# EAGLE design AQ-sensors-Hardware-design (EAGLE 9.3.1)
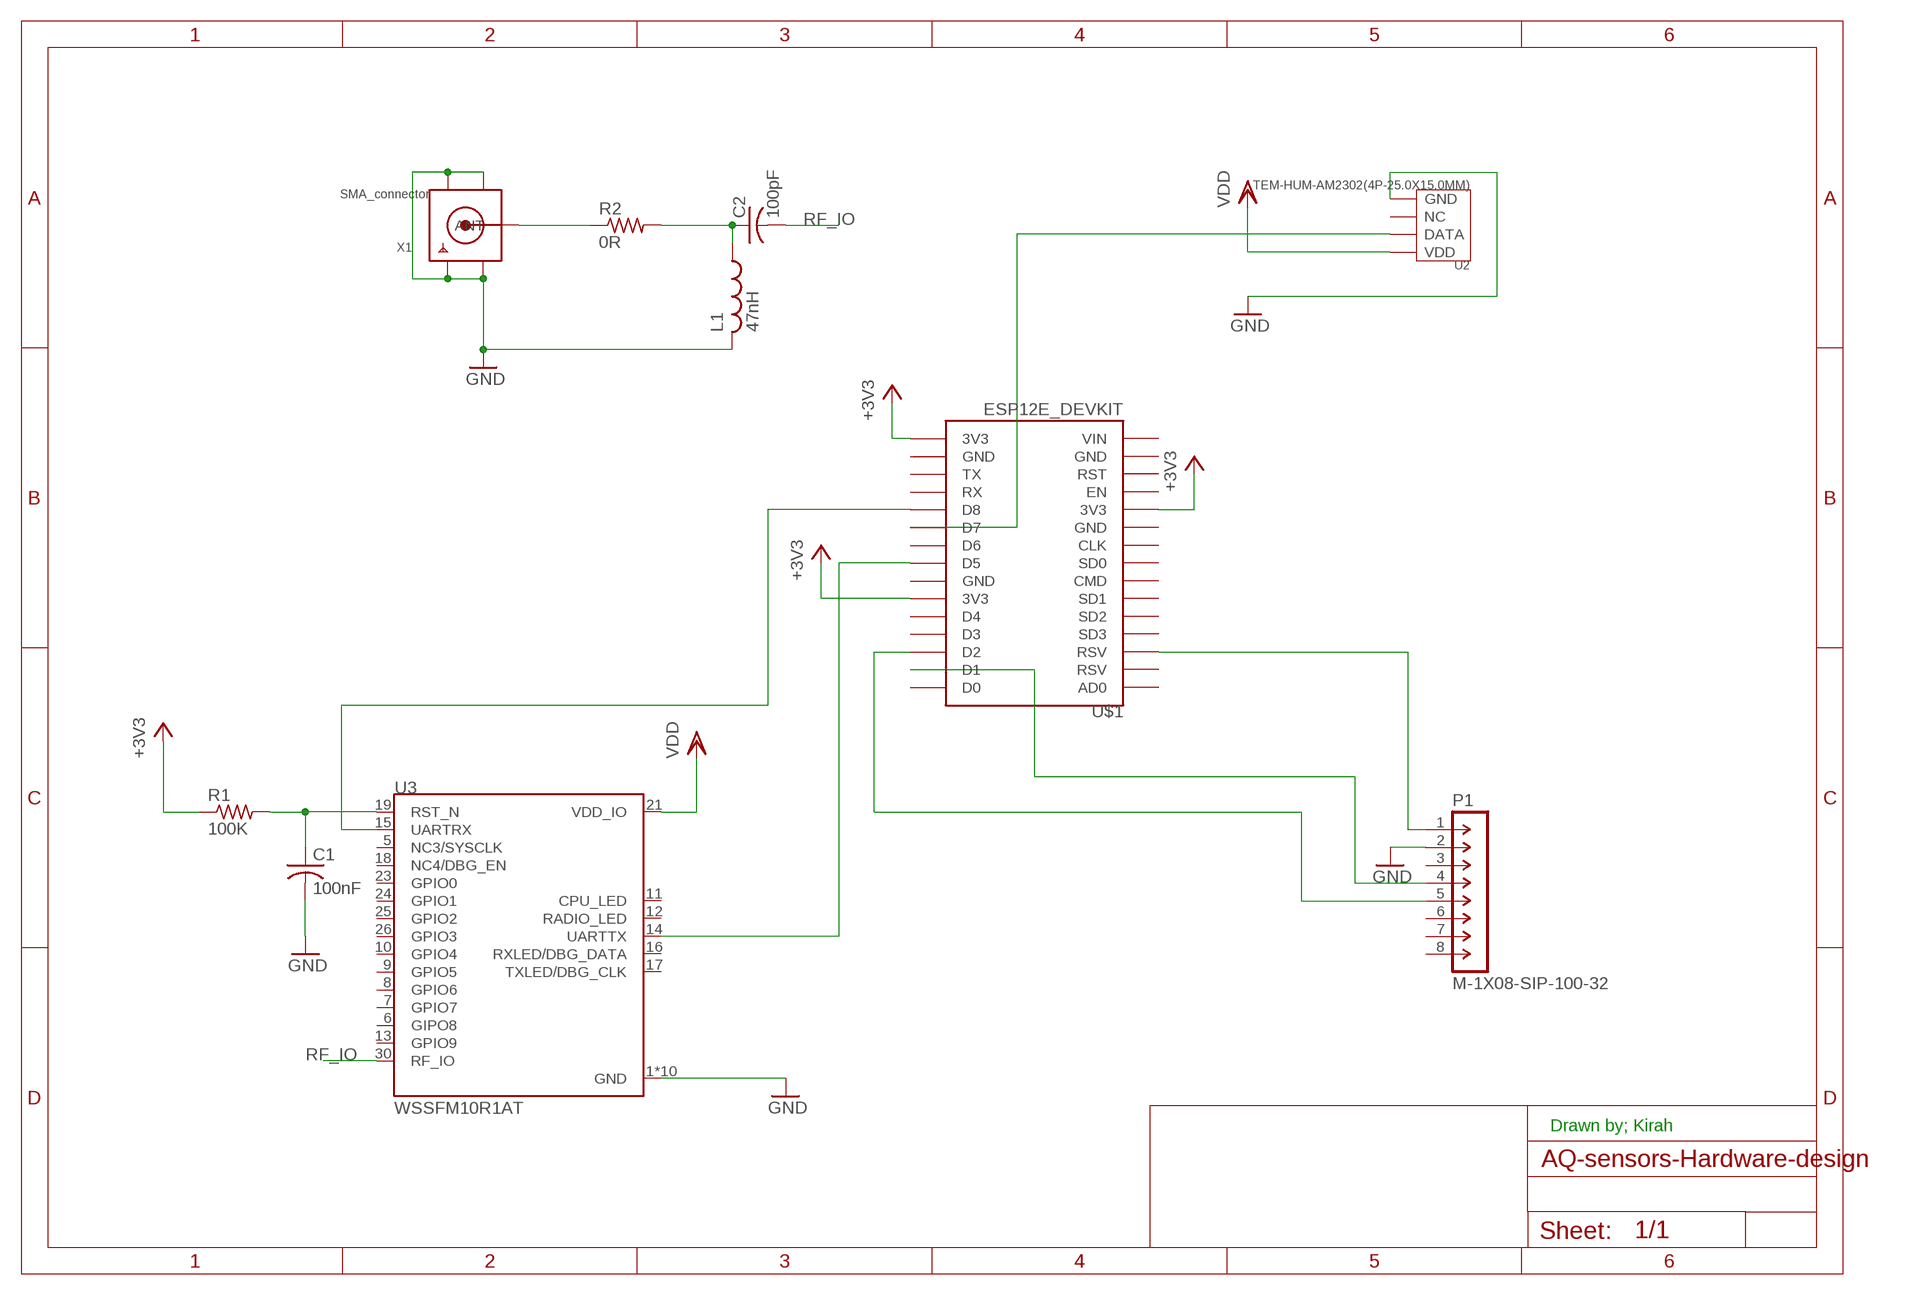
[diagram p0: schematic, sheet 1]

## Parts
C1  100nF  C-US025-025X050  [C025-025X050]
C2  100pF  C-US025-025X050  [C025-025X050]
L1  47nH  L-US0204/7  [0204/7]
P1  M-1X08-SIP-100-32  [SIP-100-08-32]
R1  100K  R-US_0204/7  [0204/7]
R2  0R  R-US_0204/7  [0204/7]
U2  TEM-HUM-AM2302(4P-25.0X15.0MM)  [SNR4-2.54-25.0X15.0X7.0MM]
U3  WSSFM10R1AT  [XCVR_WSSFM10R1AT]
U$1  ESP12E_DEVKIT  [ESP12E_DEVKIT]
X1  SMA_connector  SMACONNECTOR_EDGE_UFL  [SMA_EDGELAUNCH_UFL]

## Nets
+3V3: R1.1 U$1.3V3@0(3V3) U$1.3V3@1(3V3) U$1.3V3@2(3V3)
GND [Gnd]: C1.2 L1.2 P1.2 U2.P$4(GND) U3.1(GND) U3.2(GND) U3.3(GND) U3.4(GND) U3.20(GND) U3.22(GND) U3.27(GND) U3.28(GND) U3.29(GND) U3.31(GND) X1.GND@1(GND1) X1.GND@2(GND2) X1.GND@3(GND3) X1.GND@4(GND4)
N$1: U2.P$2(DATA) U$1.D7
N$2: C1.1 R1.2 U3.19(RST_N)
N$3: C2.1 L1.1 R2.2
N$4: P1.1 U$1.RSV@1(RSV)
N$5: R2.1 X1.P(ANT)
N$9: U3.15(UARTRX) U$1.D8
N$10: U3.14(UARTTX) U$1.D5
N$13: P1.5 U$1.D2
N$14: P1.4 U$1.D1
RF_IO: C2.2 U3.30(RF_IO)
VDD: U2.P$1(VDD) U3.21(VDD_IO)
Unconnected: P1.3 P1.6 P1.7 P1.8 U2.P$3(NC) U3.5(NC3/SYSCLK) U3.6(GIPO8) U3.7(GPIO7) U3.8(GPIO6) U3.9(GPIO5) U3.10(GPIO4) U3.11(CPU_LED) U3.12(RADIO_LED) U3.13(GPIO9) U3.16(RXLED/DBG_DATA) U3.17(TXLED/DBG_CLK) U3.18(NC4/DBG_EN) U3.23(GPIO0) U3.24(GPIO1) U3.25(GPIO2) U3.26(GPIO3) U$1.AD0 U$1.CLK U$1.CMD U$1.D0 U$1.D3 U$1.D4 U$1.D6 U$1.EN U$1.GND@0(GND) U$1.GND@1(GND) U$1.GND@2(GND) U$1.GND@3(GND) U$1.RST U$1.RSV@0(RSV) U$1.RX U$1.SD0 U$1.SD1 U$1.SD2 U$1.SD3 U$1.TX U$1.VIN

## Notes on the sheet
- Drawn by; Kirah

## Library data of the parts
C1 C2 = rcl:C-US: CAPACITOR, American symbol; SPICEPREFIX: C
L1 = rcl:L-US: INDUCTOR, American symbol; SPICEPREFIX: L
P1 = con-headers-jp:M-1X08-: MALE HEADER
R1 R2 = rcl:R-US_: RESISTOR, American symbol; SPICEPREFIX: R
U2 = TEM-HUM-AM2302_4P-25.0X15.0MM_:TEM-HUM-AM2302(4P-25.0X15.0MM): 314010001; AVAILABILITY: Unavailable; DESCRIPTION: DHT22 Temp / Humidity Sensor DHT22 Temp / Humidity Sensor; MF: MCM Electronics; MP: AM2302; PACKAGE: None; PRICE: None
U3 = WSSFM10R1AT:WSSFM10R1AT: Sigfox RF Module, Sub-1GHz , SMD; AVAILABILITY: Unavailable; DESCRIPTION: Sigfox Module Rcz1 At Version; MF: Avnet Design Services; MP: WSSFM10R1AT; PACKAGE: None; PRICE: None
U$1 = ESP12E_DEVKIT:ESP12E_DEVKIT: ESP12E DEVKIT BOARD
X1 = adafruit:SMACONNECTOR: SMA Connector 90° DIP SMA Connector, 50 Ohm (4UConnector: 07259)

## Net classes
1 Gnd: width 0.254 mm

## Board
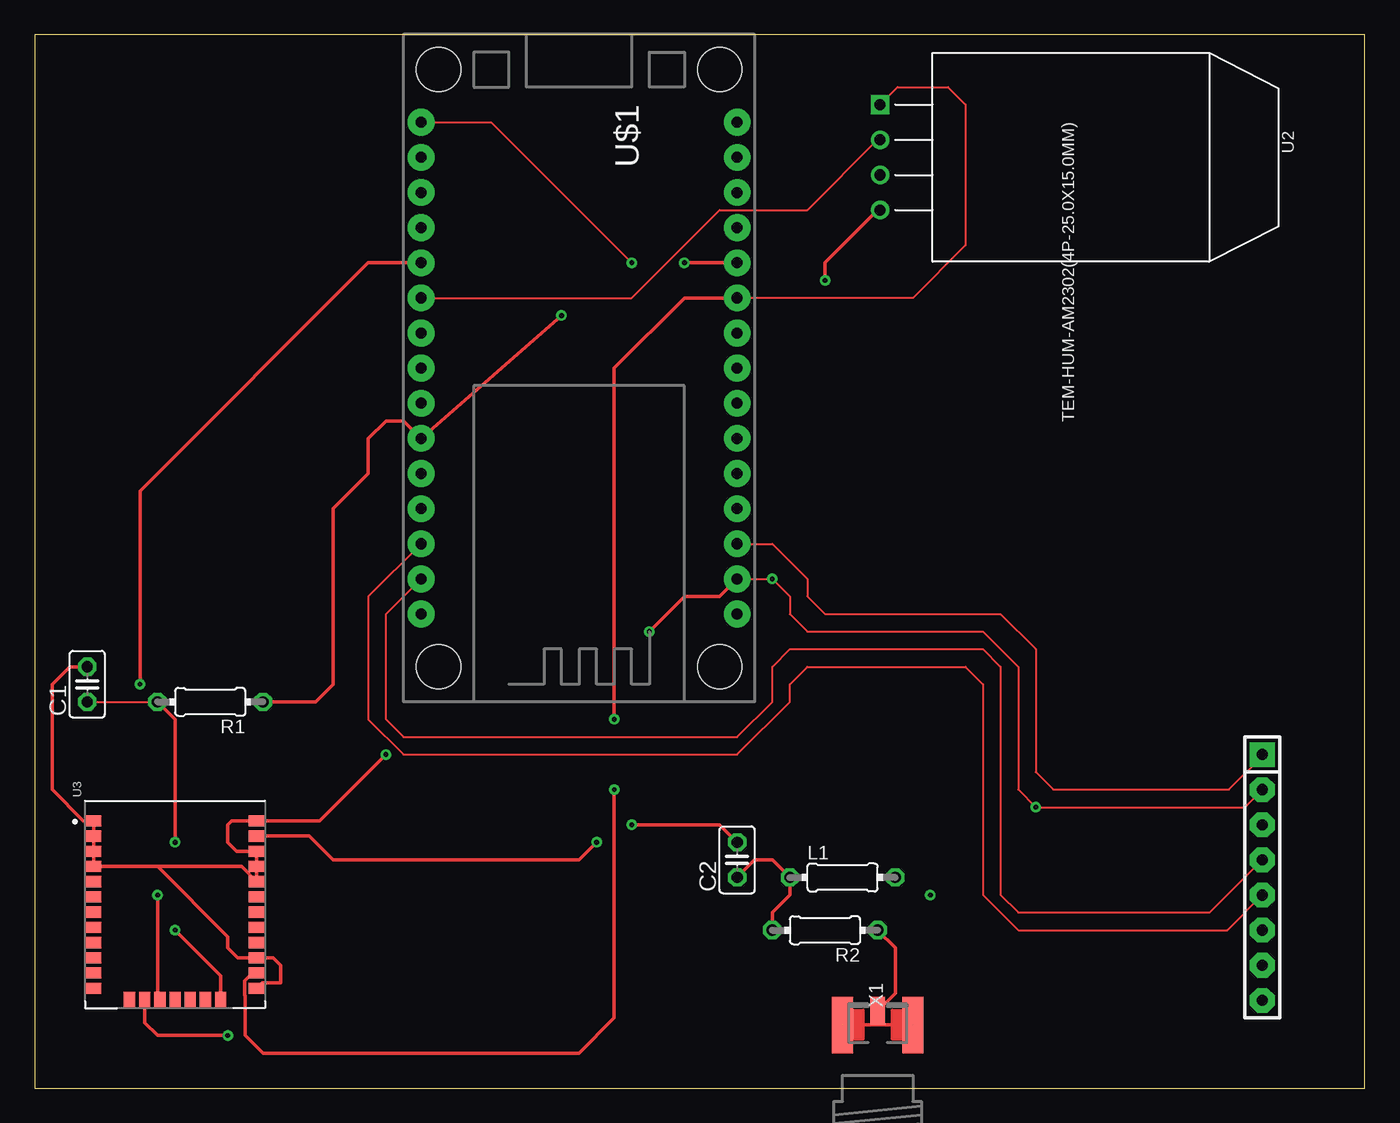
[diagram p1: board, top side]
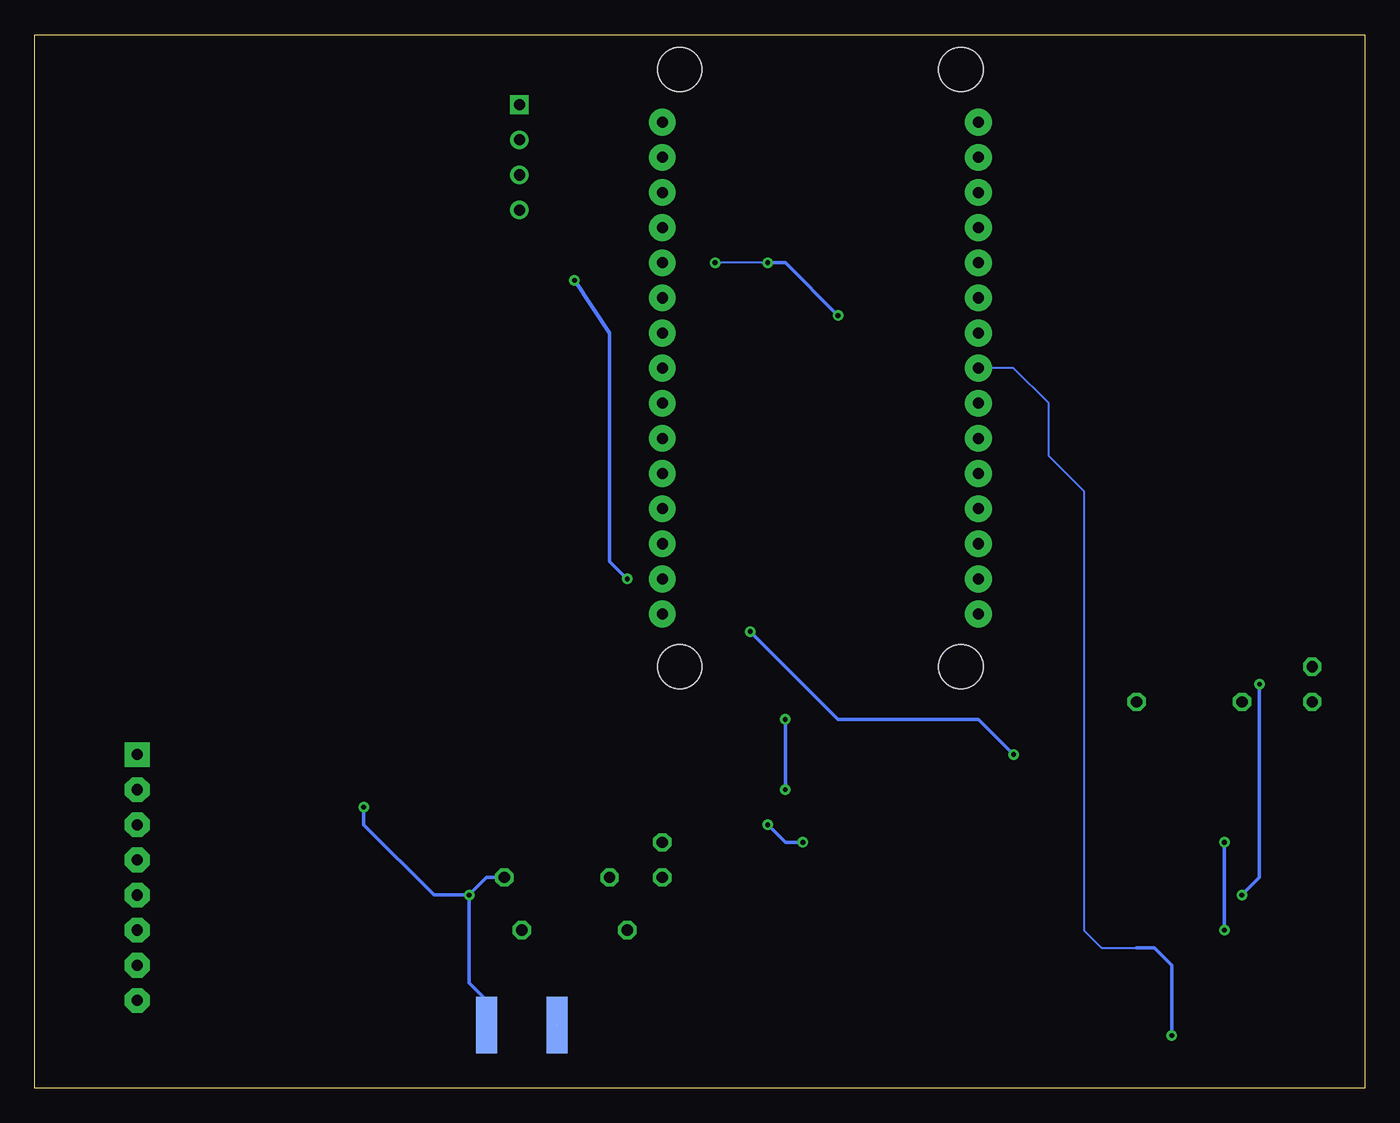
[diagram p2: board, bottom side, seen from below]

Size 96.19 x 76.19 mm. Coordinates in mm from the lower left corner, seen from the top.
Outline: 0,0 96.19,0 96.19,76.19 0,76.19 0,0
Copper layers (1*16): Top 0.035mm / dielectric 1.5mm / Bottom 0.035mm
Design rules "default": minimum track width 6mil, minimum drill 0.35mm, track to track 6mil, track to pad 6mil, pad to pad 6mil, via to via 6mil, smd to smd 6mil, copper to edge 40mil, drill to drill 6mil, minimum pad ring 10mil, minimum via ring 8mil, stop-mask expansion 4mil, vias tented up to drill 0mil, thermal gap 10mil

### Footprints (pad centres in the part's own frame; a part is rotated, then mirrored left to right if it is on the bottom)
C025-025X050 = drill 0.813 octagon: 1 -1.27,0; 2 1.27,0
0204/7 = drill 0.813 octagon: 1 -3.81,0; 2 3.81,0
SIP-100-08-32 = drill 0.813 pad 1.778 square: 1 -8.89,0 | drill 0.813 pad 1.778 octagon: 2 -6.35,0; 3 -3.81,0; 4 -1.27,0; 5 1.27,0; 6 3.81,0; 7 6.35,0; 8 8.89,0
SNR4-2.54-25.0X15.0X7.0MM = drill 0.8 pad 1.35 square: P$1 -3.81,-13.8 | drill 0.8 pad 1.35: P$2 -1.27,-13.8; P$3 1.27,-13.8; P$4 3.81,-13.8
XCVR_WSSFM10R1AT = smd 1.15 x 0.81: 1 -5.9,6.05; 2 -5.9,4.95; 3 -5.9,3.85; 4 -5.9,2.75; 5 -5.9,1.65; 6 -5.9,0.55; 7 -5.9,-0.55; 8 -5.9,-1.65; 9 -5.9,-2.75; 10 -5.9,-3.85; 11 -5.9,-4.95; 12 -5.9,-6.05; 20 5.9,-6.05; 21 5.9,-4.95; 22 5.9,-3.85; 23 5.9,-2.75; 24 5.9,-1.65; 25 5.9,-0.55; 26 5.9,0.55; 27 5.9,1.65; 28 5.9,2.75; 29 5.9,3.85; 30 5.9,4.95; 31 5.9,6.05 | smd 0.81 x 1.15: 13 -3.3,-6.9; 14 -2.2,-6.9; 15 -1.1,-6.9; 16 0,-6.9; 17 1.1,-6.9; 18 2.2,-6.9; 19 3.3,-6.9
ESP12E_DEVKIT = drill 0.8 pad 1.93: 3V3@0 -11.43,-7.62; 3V3@1 11.43,5.08; 3V3@2 11.43,-17.78; AD0 -11.43,17.78; CLK -11.43,-2.54; CMD -11.43,2.54; D0 11.43,17.78; D1 11.43,15.24; D2 11.43,12.7; D3 11.43,10.16; D4 11.43,7.62; D5 11.43,0; D6 11.43,-2.54; D7 11.43,-5.08; D8 11.43,-7.62; EN -11.43,-10.16; GND@0 -11.43,-5.08; GND@1 -11.43,-15.24; GND@2 11.43,2.54; GND@3 11.43,-15.24; RST -11.43,-12.7; RSV@0 -11.43,15.24; RSV@1 -11.43,12.7; RX 11.43,-10.16; SD0 -11.43,0; SD1 -11.43,5.08; SD2 -11.43,7.62; SD3 -11.43,10.16; TX 11.43,-12.7; VIN -11.43,-17.78 | hole 3.2: -10.16,21.59; 10.16,21.59; 10.16,-21.59; -10.16,-21.59
SMA_EDGELAUNCH_UFL = smd 4.064 x 1.524: GND@1 2.032,-2.54; GND@2 2.032,2.54 | smd 4.064 x 1.524 bottom: GND@3 2.032,2.54; GND@4 2.032,-2.54 | smd 2.032 x 1.016: P 3.048,0

### Placement (x,y rotation side)
C1  3.81,29.21 90 top
C2  50.8,16.51 90 top
L1  58.42,15.24 0 top
P1  88.77,15.24 270 top
R1  12.7,27.94 180 top
R2  57.15,11.43 180 top
U2  74.93,67.31 270 top
U3  10.16,13.28 0 top
U$1  39.37,52.07 180 top
X1  60.96,2.54 90 top

### Tracks (layer width: path | path; a pad name or v marks a point on that pad's centre or on a via)
+3V3  (via drill 0.35)
  Top 0.152: U$1.3V3@2 33.02,69.85 v43.18,59.69
  Top 0.254: v38.1,55.88 U$1.3V3@1 26.67,48.26 25.4,48.26 24.13,46.99 24.13,44.45 21.59,41.91 21.59,29.21 20.32,27.94 R1.1 | U$1.3V3@0 v46.99,59.69
  Bottom 0.152: v43.18,59.69 v46.99,59.69
  Bottom 0.254: v38.1,55.88 41.91,59.69 v43.18,59.69
GND  (via drill 0.35)  (2 unrouted)
  Top 0.152: P1.2 87.5,20.32 v72.39,20.32 71.12,21.59 71.12,30.48 68.58,33.02 55.88,33.02 54.61,34.29 54.61,35.56 v53.34,36.83 50.8,36.83
  Top 0.254: C1.2 2.54,30.48 1.27,29.21 1.27,21.59 3.52,19.34 U3.1 U3.2 U3.3 U3.4 8.89,16.03 | 8.89,16.03 14.96,16.03 U3.27 U3.28 U3.29 14.62,17.13 13.97,17.78 13.97,19.05 14.26,19.34 U3.31 20.61,19.34 v25.4,24.13 | 8.89,16.03 13.97,10.96 13.97,10.16 14.7,9.44 U3.22 17.23,9.44 17.78,8.89 17.78,7.62 16.45,7.62 U3.20 | v44.45,33.02 46.99,35.56 49.53,35.56 50.8,36.83 | U2.P$4 60.96,63.5 57.15,59.69 v57.15,58.42 | X1.GND@3 X1.GND@4
  Bottom 0.254: v25.4,24.13 27.94,26.67 38.1,26.67 v44.45,33.02 | v53.34,36.83 54.61,38.1 54.61,54.61 v57.15,58.42 | X1.GND@4 63.5,6.35 64.77,7.62 v64.77,13.97 | v64.77,13.97 63.5,15.24 L1.2 | v72.39,20.32 72.39,19.05 67.31,13.97 v64.77,13.97
N$1
  Top 0.152: U$1.D7 43.18,57.15 49.53,63.5 55.88,63.5 60.96,68.58 U2.P$2
N$2  (via drill 0.35)
  Top 0.152: C1.1 R1.2
  Top 0.254: U3.19 13.46,8.13 v10.16,11.43 | R1.2 10.16,26.67 v10.16,17.78
  Bottom 0.254: v10.16,17.78 v10.16,11.43
N$3
  Top 0.254: C2.1 52.07,16.51 53.34,16.51 L1.1 54.61,13.97 53.34,12.7 R2.2
N$4
  Top 0.152: U$1.RSV@1 53.34,39.37 55.88,36.83 55.88,35.56 57.15,34.29 69.85,34.29 72.39,31.75 72.39,22.86 73.66,21.59 86.36,21.59 88.77,24 P1.1
N$5
  Top 0.254: R2.1 62.23,10.16 62.23,6.86 X1.P
N$9  (via drill 0.35)
  Top 0.254: U3.15 8.89,6.55 v8.89,13.97 | U$1.D8 24.13,59.69 7.62,43.18 v7.62,29.21
  Bottom 0.254: v7.62,29.21 7.62,15.24 v8.89,13.97
N$10  (via drill 0.35)
  Top 0.254: U3.14 7.96,4.74 8.89,3.81 v13.97,3.81
  Bottom 0.152: 16.51,10.16 19.05,10.16 20.32,11.43 20.32,43.18 22.86,45.72 22.86,49.53 25.4,52.07 U$1.D5
  Bottom 0.254: 16.51,10.16 15.24,10.16 13.97,8.89 v13.97,3.81
N$13
  Top 0.152: U$1.D2 24.13,35.56 24.13,26.67 26.67,24.13 50.8,24.13 54.61,27.94 54.61,29.21 55.88,30.48 67.31,30.48 68.58,29.21 68.58,13.97 71.12,11.43 86.23,11.43 P1.5
N$14
  Top 0.152: P1.4 84.96,12.7 71.12,12.7 69.85,13.97 69.85,30.48 68.58,31.75 54.61,31.75 53.34,30.48 53.34,27.94 50.8,25.4 26.67,25.4 25.4,26.67 25.4,34.29 U$1.D1
RF_IO  (via drill 0.35)
  Top 0.254: U3.30 19.87,18.23 21.59,16.51 39.37,16.51 v40.64,17.78 | C2.2 49.53,19.05 v43.18,19.05
  Bottom 0.254: v40.64,17.78 41.91,17.78 v43.18,19.05
VDD  (via drill 0.35)
  Top 0.152: U2.P$1 62.4,72.39 66.04,72.39 67.31,71.12 67.31,60.96 63.5,57.15 50.8,57.15
  Top 0.254: 50.8,57.15 46.99,57.15 41.91,52.07 v41.91,26.67 | U3.21 15.79,8.33 15.21,7.76 15.21,6.71 15.24,6.68 15.24,3.81 16.51,2.54 39.37,2.54 41.91,5.08 v41.91,21.59
  Bottom 0.254: v41.91,26.67 v41.91,21.59